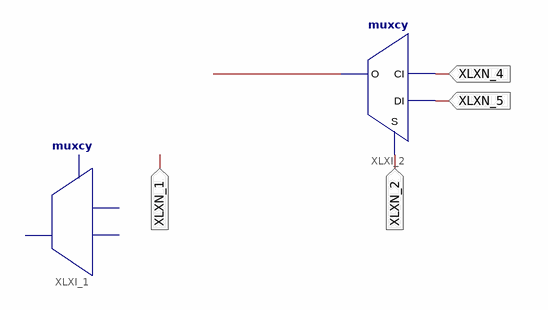
[diagram p0: schematic sheet 1]
// Xilinx ISE schematic muxanddemux.sch (spartan6) as structural Verilog: 2 symbols, 4 ports
module muxanddemux (
  input  XLXN_1,
  input  XLXN_2,
  input  XLXN_4,
  input  XLXN_5
);

  wire XLXN_3;

  muxcy XLXI_1 (.S(XLXN_1), .O(XLXN_3));  // open: CI, DI
  muxcy XLXI_2 (.CI(XLXN_4), .DI(XLXN_5), .S(XLXN_2), .O(XLXN_3));
endmodule
